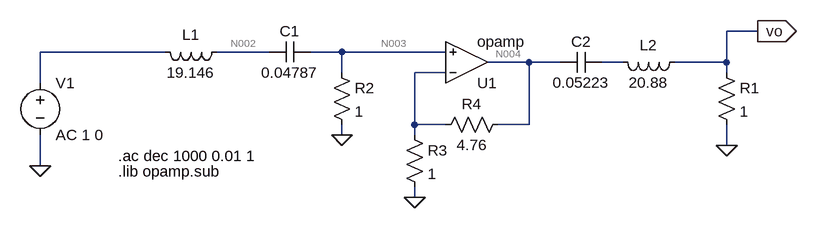
[diagram p0: schematic 20240513_Ejercicio1.asc]
20240513_Ejercicio1.asc, the LTspice schematic file:
Version 4
SHEET 1 1448 680
WIRE 1072 96 1024 96
WIRE 160 128 -32 128
WIRE 320 128 240 128
WIRE 432 128 384 128
WIRE 592 128 432 128
WIRE 720 144 656 144
WIRE 768 144 720 144
WIRE 864 144 832 144
WIRE 1024 144 1024 96
WIRE 1024 144 944 144
WIRE 432 160 432 128
WIRE 592 160 544 160
WIRE 1024 160 1024 144
WIRE -32 176 -32 128
WIRE 544 240 544 160
WIRE 592 240 544 240
WIRE 720 240 720 144
WIRE 720 240 672 240
WIRE 432 256 432 240
WIRE 544 256 544 240
WIRE 1024 272 1024 240
WIRE -32 304 -32 256
WIRE 544 352 544 336
FLAG 1072 96 vo
IOPIN 1072 96 Out
FLAG -32 304 0
FLAG 432 256 0
FLAG 1024 272 0
FLAG 544 352 0
SYMBOL cap 384 112 R90
WINDOW 0 0 32 VBottom 2
WINDOW 3 32 32 VTop 2
SYMATTR InstName C1
SYMATTR Value 0.04787
SYMBOL ind 256 112 R90
WINDOW 0 5 56 VBottom 2
WINDOW 3 32 56 VTop 2
SYMATTR InstName L1
SYMATTR Value 19.146
SYMATTR SpiceLine Rser=0
SYMBOL voltage -32 160 R0
SYMATTR InstName V1
SYMATTR Value AC 1 0
SYMBOL res 416 144 R0
SYMATTR InstName R2
SYMATTR Value 1
SYMBOL cap 832 128 R90
WINDOW 0 0 32 VBottom 2
WINDOW 3 32 32 VTop 2
SYMATTR InstName C2
SYMATTR Value 0.05223
SYMBOL ind 960 128 R90
WINDOW 0 5 56 VBottom 2
WINDOW 3 32 56 VTop 2
SYMATTR InstName L2
SYMATTR Value 20.88
SYMBOL res 1008 144 R0
SYMATTR InstName R1
SYMATTR Value 1
SYMBOL OpAmps\\opamp 624 208 M180
SYMATTR InstName U1
SYMBOL res 528 240 R0
SYMATTR InstName R3
SYMATTR Value 1
SYMBOL res 688 224 R90
WINDOW 0 0 56 VBottom 2
WINDOW 3 32 56 VTop 2
SYMATTR InstName R4
SYMATTR Value 4.76
TEXT 88 288 Left 2 !.ac dec 1000 0.01 1
TEXT 88 312 Left 2 !.lib opamp.sub

The netlist it stands for:
* 20240513_Ejercicio1.asc
C1 N003 N002 0.04787
L1 N002 N001 19.146 Rser=0
V1 N001 0 AC 1 0
R2 N003 0 1
C2 N005 N004 0.05223
L2 vo N005 20.88
R1 vo 0 1
XU1 N006 N003 N004 opamp Aol=100K GBW=10Meg  ; pins invin noninvin out
R3 N006 0 1
R4 N004 N006 4.76
.ac dec 1000 0.01 1
.lib opamp.sub
.backanno
.end

* Results of the author's LTspice run, read from the files saved beside the schematic
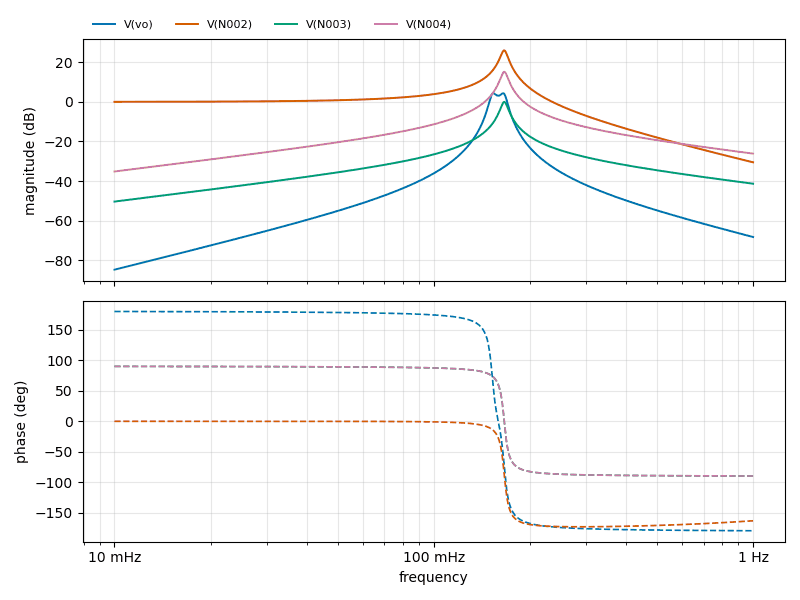
[diagram p1: AC Analysis of 20240513_Ejercicio1.asc, plotted from the saved traces]
* AC Analysis, 1 run:
*   V(vo): -84.84 dB at 10 mHz, -68.31 dB at 1 Hz, peak 4.37 dB at 164.8 mHz, 3 dB below the peak at 150.1 mHz and 168.8 mHz
*   V(N002): 0.03 dB at 10 mHz, -30.55 dB at 1 Hz, peak 26.03 dB at 166 mHz, 3 dB below the peak at 161.9 mHz and 170.3 mHz
*   V(N003): -50.40 dB at 10 mHz, -41.36 dB at 1 Hz, peak -0.00 dB at 166.3 mHz, 3 dB below the peak at 162.1 mHz and 170.5 mHz
*   V(N004): -35.20 dB at 10 mHz, -26.15 dB at 1 Hz, peak 15.21 dB at 166.3 mHz, 3 dB below the peak at 162.1 mHz and 170.5 mHz